# Altium schematic sheet ReflectanceSensor.SchDoc
size A4; SheetNumber: 1; SheetTotal: 1
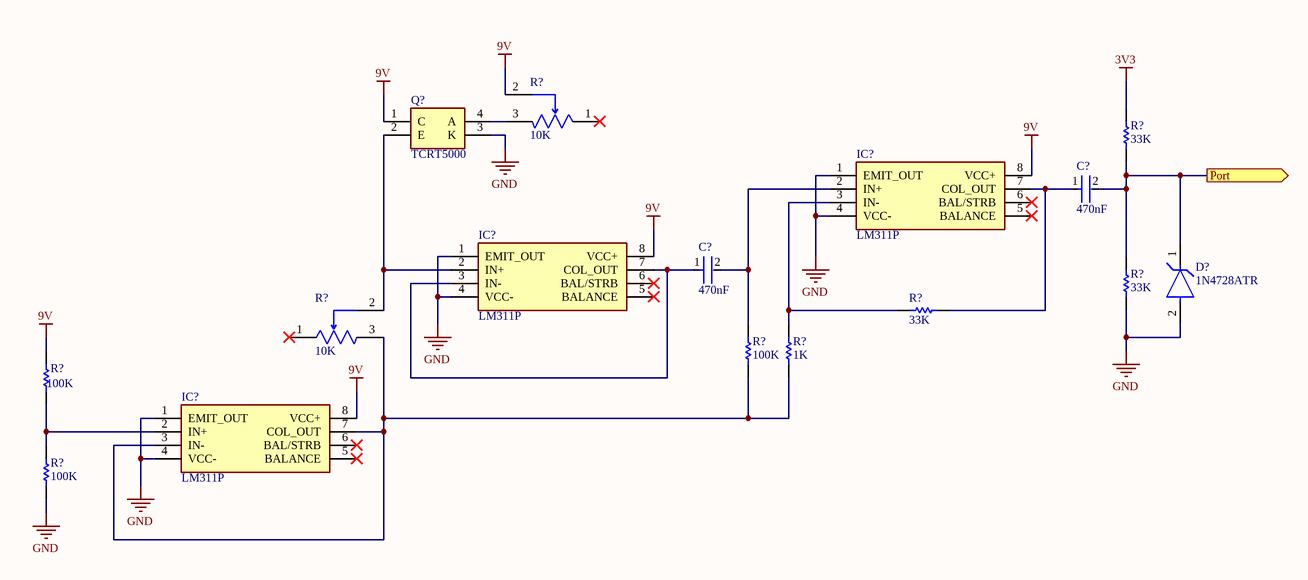
[diagram p0: ReflectanceSensor.SchDoc]

## Parts
(Parts that share a designator on the sheet are numbered #1, #2 ... from top to bottom, then left to right.)
C?#1  470nF  [FP-F102K43Y5RP6UK5R-MFG]
C?#2  470nF  [FP-F102K43Y5RP6UK5R-MFG]
D?  1N4728ATR  [FP-017AH-MFG]
IC?#1  LM311P  [DIP794W53P254L959H508Q8N]
IC?#2  LM311P  [DIP794W53P254L959H508Q8N]
IC?#3  LM311P  [DIP794W53P254L959H508Q8N]
Q?  TCRT5000  [TCRT5000]
R?#1  10K  [FP-3296W-MFG]
R?#2  33K  [RESA60-630X240]
R?#3  33K  [RESA60-630X240]
R?#4  33K  [RESA60-630X240]
R?#5  10K  [FP-3296W-MFG]
R?#6  100K  [RESA60-630X240]
R?#7  1K  [RESA60-630X240]
R?#8  100K  [RESA60-630X240]
R?#9  100K  [RESA60-630X240]

## Ports
Port (out)

## Nets
3V3: R?#2.1
9V: IC?#1.8(VCC+) IC?#2.8(VCC+) IC?#3.8(VCC+) Q?.1(C) R?#1.2(WIPER) R?#8.2
GND: D?.2(A) IC?#1.1(EMIT_OUT) IC?#1.4(VCC-) IC?#2.1(EMIT_OUT) IC?#2.4(VCC-) IC?#3.1(EMIT_OUT) IC?#3.4(VCC-) Q?.3(K) R?#3.2 R?#9.1
Port: C?#1.2 D?.1(C) R?#2.2 R?#3.1 ; port Port
NetC?#1_1: C?#1.1 IC?#1.7(COL_OUT) R?#4.1
NetC?#2_1: C?#2.1 IC?#2.3(IN-) IC?#2.7(COL_OUT)
NetC?#2_2: C?#2.2 IC?#1.2(IN+) R?#6.2
NetIC?#1_3: IC?#1.3(IN-) R?#4.2 R?#7.2
NetIC?#2_2: IC?#2.2(IN+) Q?.2(E) R?#5.2(WIPER)
NetIC?#3_2: IC?#3.2(IN+) R?#8.1 R?#9.2
NetIC?#3_3: IC?#3.3(IN-) IC?#3.7(COL_OUT) R?#5.3(CW) R?#6.1 R?#7.1
NetQ?_4: Q?.4(A) R?#1.3(CW)

Not connected (* = marked no-connect by the designer): IC?#1 5(BALANCE)* 6(BAL/STRB)*; IC?#2 5(BALANCE)* 6(BAL/STRB)*; IC?#3 5(BALANCE)* 6(BAL/STRB)*; R?#1 1(CCW)*; R?#5 1(CCW)*

## Library data of the parts
C?#1 C?#2 = CMP-00030-44025813-1: F102K43Y5RP6UK5R Ceramic Capacitor, Ceramic, 2000V, 10% +Tol, 10% -Tol, Y5R, 15% TC, 0.001uF, Through Hole Mount; Voltage Rating (AC): 2kV; Insulation Resistance: 10GΩ; Lead Diameter: 800µm; Capacitance: 1nF; Lead/Base Style: Kinked; Length: 11mm; Radiation Hardening: No; Composition: Ceramic; RoHS: Compliant; Lead Pitch: 5mm; Termination: Radial; Width: 11mm; Dielectric: Y5R; REACH SVHC: Unknown; Voltage: 2kV; Material: Ceramic; NexarPartId: 44025813; Tolerance: 10%; Dielectric Material: Ceramic; Voltage Rating: 2kV; Max Operating Temperature: 125°C; Number of Pins: 2; Min Operating Temperature: -30°C; Depth: 5mm; Schedule B: 8532230060, 8532230060; Height: 15.8mm; Voltage Rating (DC): 2kV; Mount: Through Hole; Case/Package: Radial
D? = CMP-00278-84408757-1: 1N4728ATR 1N4728 Series 1 W 3.3 V 100 uA Through Hole Zener Diode - DO-41; Manufacturer Lifecycle Status: ACTIVE; Zener Current: 76mA; Peak Reverse Current: 100µA; Power Dissipation: 1W; Element Configuration: Single; Tolerance: 5%; Working Voltage: 3.3V; Material: Glass; Output Current: 330mA; ESD Protection: No; Impedance: 10Ω; Forward Voltage: 1.2V; Radiation Hardening: No; Min Operating Temperature: -65°C; Mount: Through Hole; Number of Pins: 2; Test Current: 76mA; Contact Plating: Tin; Max Reverse Leakage Current: 100µA; Packaging: Cut Tape; RoHS: Compliant; Weight: 245mg; Max Operating Temperature: 200°C; NexarPartId: 84408757; Lifecycle Status: Production; Zener Voltage: 3.3V; REACH SVHC: No SVHC; Lead Free: Lead Free; Max Power Dissipation: 1W; Voltage Rating (DC): 3.3V; Diameter: 2.72mm; Schedule B: 8541100050, 8541100050; Power Rating: 1W; Voltage Tolerance: 5%; Length: 5.2mm
IC?#1-IC?#3 = LM311P: Integrated Circuit; Manufacturer_Name: Texas Instruments; Datasheet Link: http://www.ti.com/lit/ds/symlink/lm311.pdf; Height: 5.08mm; Manufacturer_Part_Number: LM311P; Mouser Part Number: 595-LM311P; Mouser Price/Stock: https://www.mouser.co.uk/ProductDetail/Texas-Instruments/LM311P?qs=0OT4q4QBUTKsKDe9sMZxLw%3D%3D; Arrow Part Number: LM311P; Arrow Price/Stock: https://www.arrow.com/en/products/lm311p/texas-instruments?region=nac
Q? = TCRT5000: Transistor; Manufacturer_Name: Vishay; Datasheet Link: http://www.vishay.com/docs/83760/tcrt5000.pdf; Height: 6.8mm; Manufacturer_Part_Number: TCRT5000; Mouser Part Number: 782-TCRT5000; Mouser Price/Stock: https://www.mouser.co.uk/ProductDetail/Vishay-Semiconductors/TCRT5000?qs=glpcD2KT6uaaYldHGIIt5g%3D%3D; Arrow Part Number: TCRT5000; Arrow Price/Stock: https://www.arrow.com/en/products/tcrt5000/vishay?region=nac
R?#1 R?#5 = CMP-2000-05582-2: TRIMMER 2K OHM 0.5W PC PIN TOP; Resistance Tolerance: 10%; Max Power Dissipation: 500mW; Number of Turns: 25; Temperature Coefficient: 100ppm/°C; Resistance: 2kR; Taper: Linear; Width: 9.53mm; Radiation Hardening: No; Length: 9.53mm; Packaging: Rail/Tube; Lead Free: Lead Free; Mount: Panel; Min Operating Temperature: -55°C; Power Rating: 500mW; RoHS Compliant: Yes; REACH SVHC: No SVHC; Color: Blue; Package Quantity: 50; Contact Plating: Tin; Weight: 0.03oz; Technology: CERMET; Max Operating Temperature: 125°C; Tolerance: 10%; Termination: Pin; Resistor Type: Cermet; Military Standard: Not; Height: 0.395inch; Series: 3296; Depth: 4.83mm
R?#2-R?#4 R?#6-R?#9 = CMP-1659-00073-1: Axial Resistor, 100 KOhm, +/- 1%, 0.25 W, -55 to 155 degC, 2-Pin THD, RoHS, Bulk; Voltage Rating: 250 V; Power Rating: 250 mW; Resistance: 475 Ohm; PackageDescription: 2-Pin Axial Lead, Dia 2.4 mm, Body Length 6.3 mm; PackageReference: MFR-25; Length: 0.248 inch; ComponentLink2Description: Datasheet; Packaging: Bulk; DatasheetVersion: Apr-13; Package Quantity: 200; Min Operating Temperature: -55 degC; ComponentLink2URL: http://www.yageo.com/documents/recent/Yageo%20LR_MFR_2013.pdf; RoHSCompliant: true; ComponentLink1URL: http://www.yageo.com/; Tolerance: 1%; Case\Package: Axial; Mount: Through Hole; ComponentLink1Description: Manufacturer URL; Max Operating Temperature: 155 degC